# Altium project Power.PrjPcb
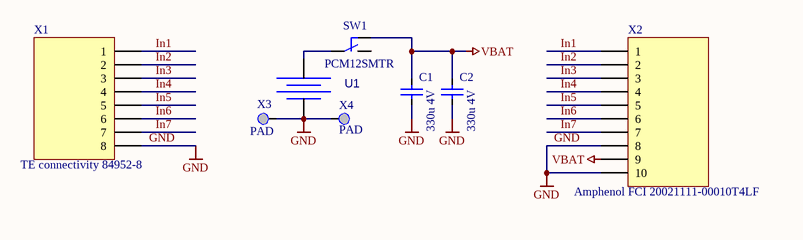
[diagram p0: Power.SchDoc]
1 sheet, 8 parts. Net scope: global (net labels, ports and power ports of the same name join across sheets).
Board file: Power.PcbDoc

## Sheet Power.SchDoc
size A4

### Parts
C1  330u 4V  [CAPC3225L]
C2  330u 4V  [CAPC3225L]
SW1  PCM12SMTR  [PCM12SMTR]
U1  Keystone 3000  [BK-3000]  (value not drawn)
X1  TE connectivity 84952-8  [ZIF connector 84952-8]
X2  Amphenol FCI 20021111-00010T4LF  [HDR-1.27mm-2X5]
X3  PAD  [PAD3mm]
X4  PAD  [PAD3mm]

### Nets
GND: C1.2 C2.2 U1.2(-) X1.8 X2.8 X2.10 X3.1 X4.1
VBAT: C1.1 C2.1 SW1.3 X2.9
In1: X1.1 X2.1
In2: X1.2 X2.2
In3: X1.3 X2.3
In4: X1.4 X2.4
In5: X1.5 X2.5
In6: X1.6 X2.6
In7: X1.7 X2.7
NetSW1_2: SW1.2 U1.1(+)

Not connected (* = marked no-connect by the designer): SW1 1

### Library data of the parts
C1 C2 = Capacitor: PartNumber: 490-13976-1-ND #Digikey; Value: 330u 4V; Package: 1210
SW1 = SPDT: Miniature Surface Mount Switches; PartNumber: 401-2016-1-ND #Digikey; Value: PCM12SMTR
U1 = Battery: PartNumber: 36-3000CT-ND #Digikey; Value: Keystone 3000; Package: CR1220 battery
X1 = DB-8F: Header; PartNumber: A100249CT-ND #Digikey; Value: TE connectivity 84952-8; Package: ZIF-8
X2 = DB-10F: Header; PartNumber: 609-3712-ND #Digikey; Value: Amphenol FCI 20021111-00010T4LF
X3 X4 = PAD: PartNumber: -; Value: -

## Assembly variants
ECOG: not fitted C23 C24 C25 C27 R7 R7 R7 R7 R7 R7 R7 R16 R16 R16 R16 R16 R16 R16 R18 R19
CHEMICAL: not fitted C1 C1 C1 C1 C1 C2 C2 C2 C2 C2 C3 C3 C3 C3 C3 C3 C3 C4 C4 C4 C4 C4 C4 C4 C5 C5 C5 C5 C5 C6 C6 C6 C6 C6 C6 C6 C23 C24 C25 C27 R1 R1 R1 R1 R1 R2 R2 R2 R2 R2 R3 R3 R3 R3 R3 R3 R3 R4 R4 R4 R4 R4 R5 R5 R5 R5 R5 R6 R6 R6 R6 R6 R7 R7 R7 R7 R7 R8 R8 R8 R8 R8 R9 R9 R9 R9 R9 R9 R9 R10 R10 R10 R10 R10 R10 R10 R16 R16 R16 R16 R16 U1 U1 U1 U1 U1 U2 U2 U2 U2 U2
EMG: not fitted C23 C24 C25 C27 R7 R7 R7 R7 R7 R7 R7 R16 R16 R16 R16 R16 R16 R16 R18 R19